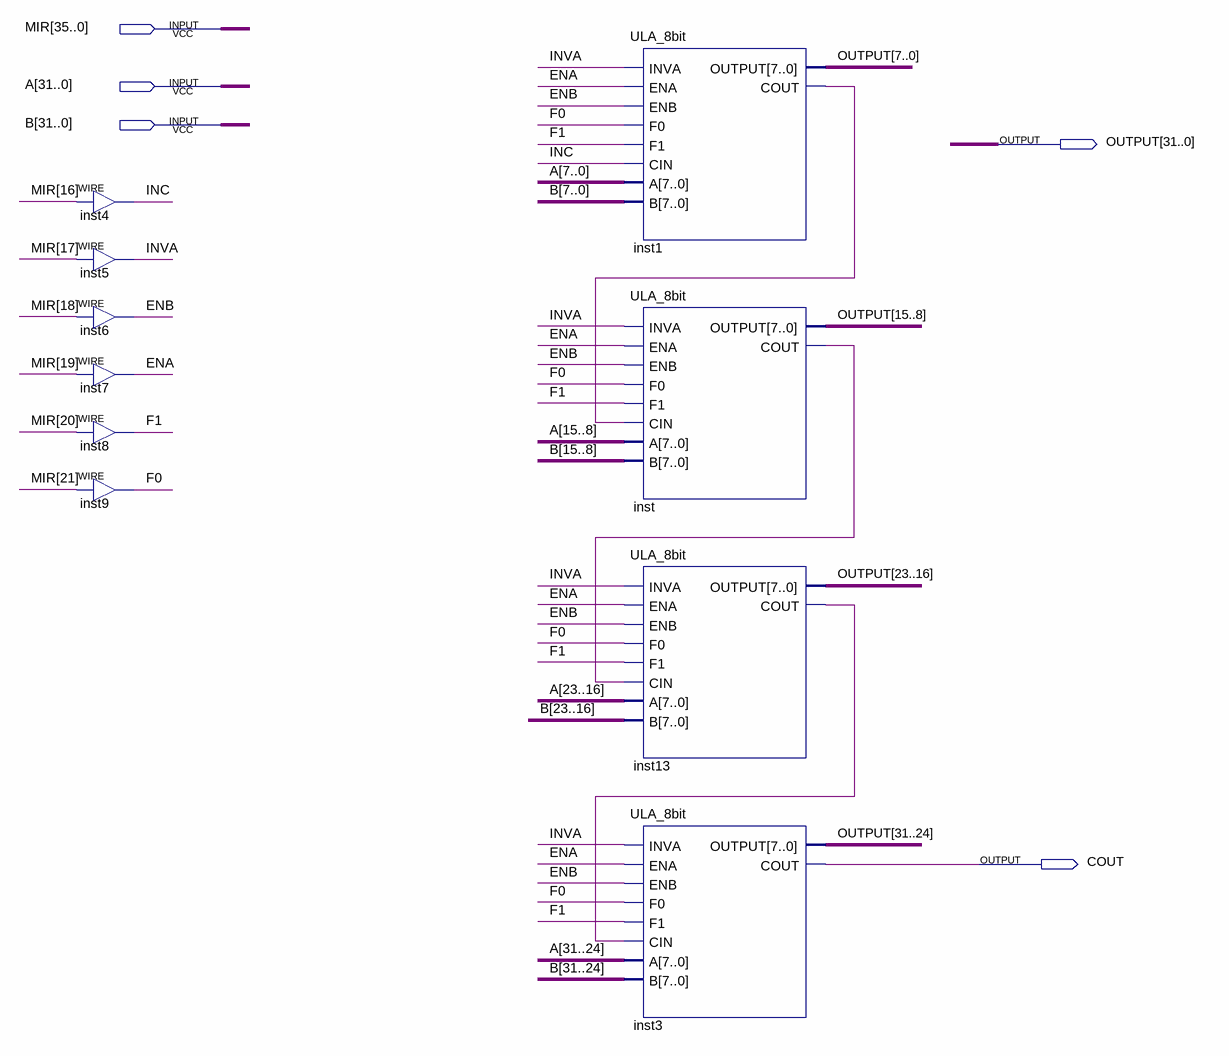
[diagram p0: schematic sheet]
// Quartus schematic ULA_32bit.bdf as structural Verilog: 10 symbols, 5 pins
module ULA_32bit (
  input  [35:0] MIR,
  input  [31:0] A,
  input  [31:0] B,
  output [31:0] OUTPUT,
  output COUT
);

  wire ENA, ENB, F0, F1, INC, inst1_cout, inst13_cout, inst_cout, INVA;

  assign INC = MIR[16];  // WIRE inst4
  assign INVA = MIR[17];  // WIRE inst5
  assign ENB = MIR[18];  // WIRE inst6
  assign ENA = MIR[19];  // WIRE inst7
  assign F1 = MIR[20];  // WIRE inst8
  assign F0 = MIR[21];  // WIRE inst9
  ULA_8bit inst1 (
    .INVA(INVA), .ENA(ENA), .ENB(ENB), .F0(F0), .F1(F1), .CIN(INC), .A(A[7:0]), .B(B[7:0]),
    .OUTPUT(OUTPUT[7:0]), .COUT(inst1_cout));
  ULA_8bit inst (
    .INVA(INVA), .ENA(ENA), .ENB(ENB), .F0(F0), .F1(F1), .CIN(inst1_cout), .A(A[15:8]), .B(B[15:8]),
    .OUTPUT(OUTPUT[15:8]), .COUT(inst_cout));
  ULA_8bit inst13 (
    .INVA(INVA), .ENA(ENA), .ENB(ENB), .F0(F0), .F1(F1), .CIN(inst_cout), .A(A[23:16]), .B(B[23:16]),
    .OUTPUT(OUTPUT[23:16]), .COUT(inst13_cout));
  ULA_8bit inst3 (
    .INVA(INVA), .ENA(ENA), .ENB(ENB), .F0(F0), .F1(F1), .CIN(inst13_cout), .A(A[31:24]), .B(B[31:24]),
    .OUTPUT(OUTPUT[31:24]), .COUT(COUT));
endmodule
